# EAGLE schematic bms 5 (EAGLE 9.6.2)
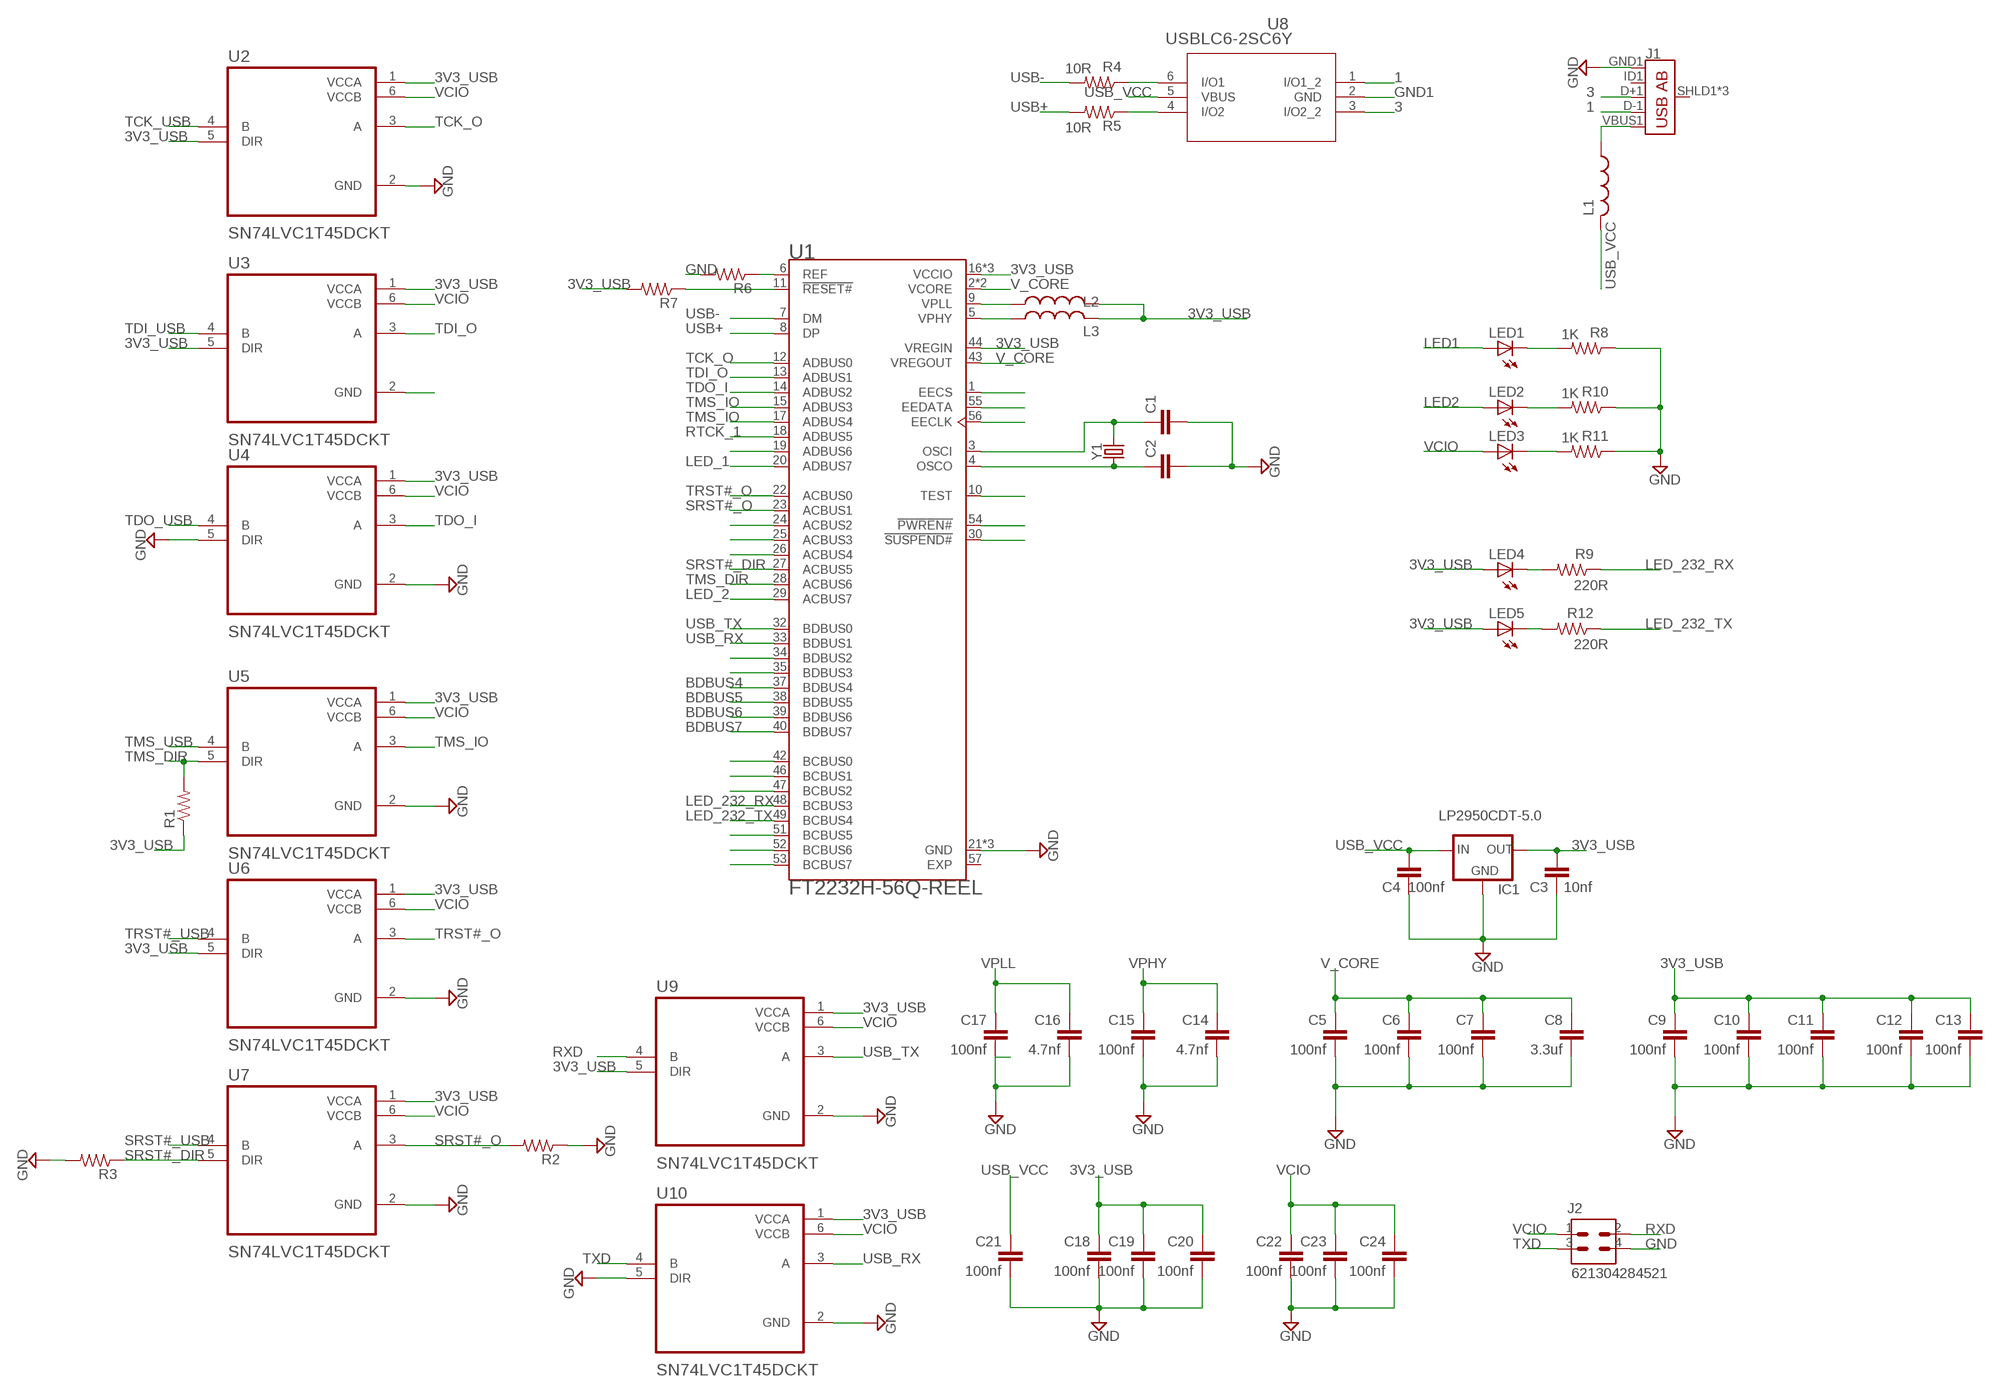
[diagram p0: schematic, sheet 1]

## Parts
C1  C-EUC0603  [C0603]
C2  C-EUC0603  [C0603]
C3  10nf  C-EUC0603  [C0603]
C4  100nf  C-EUC0603  [C0603]
C5  100nf  C-EUC0603  [C0603]
C6  100nf  C-EUC0603  [C0603]
C7  100nf  C-EUC0603  [C0603]
C8  3.3uf  C-EUC0603  [C0603]
C9  100nf  C-EUC0603  [C0603]
C10  100nf  C-EUC0603  [C0603]
C11  100nf  C-EUC0603  [C0603]
C12  100nf  C-EUC0603  [C0603]
C13  100nf  C-EUC0603  [C0603]
C14  4.7nf  C-EUC0603  [C0603]
C15  100nf  C-EUC0603  [C0603]
C16  4.7nf  C-EUC0603  [C0603]
C17  100nf  C-EUC0603  [C0603]
C18  100nf  C-EUC0603  [C0603]
C19  100nf  C-EUC0603  [C0603]
C20  100nf  C-EUC0603  [C0603]
C21  100nf  C-EUC0603  [C0603]
C22  100nf  C-EUC0603  [C0603]
C23  100nf  C-EUC0603  [C0603]
C24  100nf  C-EUC0603  [C0603]
IC1  LP2950CDT-5.0  [DPACK]
J1  USB_AB_SMT  [USB-AB-MICRO-SMD]
J2  621304284521  [621304284521]
L1  L-USL2012C  [L2012C]
L2  L-USL2012C  [L2012C]
L3  L-USL2012C  [L2012C]
LED1  LED  [SMARTLED-TTW]
LED2  LED  [SMARTLED-TTW]
LED3  LED  [SMARTLED-TTW]
LED4  LED  [SMARTLED-TTW]
LED5  LED  [SMARTLED-TTW]
R1  R-US_M0805  [M0805]
R2  R-US_M0805  [M0805]
R3  R-US_M0805  [M0805]
R4  10R  R-US_M0805  [M0805]
R5  10R  R-US_M0805  [M0805]
R6  12K  R-US_M0805  [M0805]
R7  1K  R-US_M0805  [M0805]
R8  1K  R-US_M0805  [M0805]
R9  220R  R-US_M0805  [M0805]
R10  1K  R-US_M0805  [M0805]
R11  1K  R-US_M0805  [M0805]
R12  220R  R-US_M0805  [M0805]
U1  FT2232H-56Q-REEL  [QFN50P800X800X100-57N]
U2  SN74LVC1T45DCKT  [SOT65P210X110-6N]
U3  SN74LVC1T45DCKT  [SOT65P210X110-6N]
U4  SN74LVC1T45DCKT  [SOT65P210X110-6N]
U5  SN74LVC1T45DCKT  [SOT65P210X110-6N]
U6  SN74LVC1T45DCKT  [SOT65P210X110-6N]
U7  SN74LVC1T45DCKT  [SOT65P210X110-6N]
U8  USBLC6-2SC6Y  [SOT23-6L_STM]
U9  SN74LVC1T45DCKT  [SOT65P210X110-6N]
U10  SN74LVC1T45DCKT  [SOT65P210X110-6N]
Y1  CRYSTAL-12MHZ  [CRYSTAL-SMD-2X2.5MM]

## Nets
1: J1.D-1(D-) U8.1(I/O1_2)
3: J1.D+1(D+) U8.3(I/O2_2)
3V3_USB: C3.2 C9.2 C10.2 C11.2 C12.2 C13.2 C18.2 C19.2 C20.2 IC1.3(OUT) L2.2 L3.2 LED4.A@1(A) LED5.A@1(A) R1.1 R7.2 U1.16(VCCIO) U1.36(VCCIO) U1.44(VREGIN) U1.50(VCCIO) U2.1(VCCA) U2.5(DIR) U3.1(VCCA) U3.5(DIR) U4.1(VCCA) U5.1(VCCA) U6.1(VCCA) U6.5(DIR) U7.1(VCCA) U9.1(VCCA) U9.5(DIR) U10.1(VCCA)
BDBUS4: U1.37(BDBUS4)
BDBUS5: U1.38(BDBUS5)
BDBUS6: U1.39(BDBUS6)
BDBUS7: U1.40(BDBUS7)
EECLK: U1.56(EECLK)
EECS: U1.1(EECS)
EEDATA: U1.55(EEDATA)
GND: C1.2 C2.2 C3.1 C4.1 C5.1 C6.1 C7.1 C8.1 C9.1 C10.1 C11.1 C12.1 C13.1 C14.1 C15.1 C16.1 C17.1 C18.1 C19.1 C20.1 C21.1 C22.1 C23.1 C24.1 IC1.4(GND) J1.GND1(GND) J2.4 R2.1 R3.2 R6.2 R8.1 R10.1 R11.1 U1.21(GND) U1.41(GND) U1.45(GND) U2.2(GND) U4.2(GND) U4.5(DIR) U5.2(GND) U6.2(GND) U7.2(GND) U9.2(GND) U10.2(GND) U10.5(DIR)
GND1: U8.2(GND)
LED1: LED1.A@1(A)
LED2: LED2.A@1(A)
LED_1: U1.20(ADBUS7)
LED_2: U1.29(ACBUS7)
LED_232_RX: R9.1 U1.48(BCBUS3)
LED_232_TX: R12.1 U1.49(BCBUS4)
N$1: J1.VBUS1(VBUS) L1.1
N$2: L2.1 U1.9(VPLL)
N$3: L3.1 U1.5(VPHY)
N$4: C2.1 U1.4(OSCO) Y1.P1
N$5: C1.1 U1.3(OSCI) Y1.P3
N$6: R6.1 U1.6(REF)
N$7: U1.19(ADBUS6)
N$8: R4.1 U8.6(I/O1)
N$9: U1.10(TEST)
N$10: R5.1 U8.4(I/O2)
N$11: U1.24(ACBUS2)
N$12: U1.25(ACBUS3)
N$13: U1.26(ACBUS4)
N$14: U3.2(GND)
N$15: R7.1 U1.11(!RESET#)
N$16: U1.54(!PWREN#)
N$17: U1.30(!SUSPEND#)
N$21: U1.34(BDBUS2)
N$22: U1.35(BDBUS3)
N$24: LED1.C@1(C) R8.2
N$25: U1.42(BCBUS0)
N$26: U1.46(BCBUS1)
N$27: U1.47(BCBUS2)
N$28: LED2.C@1(C) R10.2
N$29: LED3.C@1(C) R11.2
N$30: U1.51(BCBUS5)
N$31: U1.52(BCBUS6)
N$32: U1.53(BCBUS7)
N$36: LED4.C@1(C) R9.2
N$37: LED5.C@1(C) R12.2
RTCK_1: U1.18(ADBUS5)
RXD: J2.2 U9.4(B)
SRST#_DIR: R3.1 U1.27(ACBUS5) U7.5(DIR)
SRST#_O: R2.2 U1.23(ACBUS1) U7.3(A)
SRST#_USB: U7.4(B)
TCK_O: U1.12(ADBUS0) U2.3(A)
TCK_USB: U2.4(B)
TDI_O: U1.13(ADBUS1) U3.3(A)
TDI_USB: U3.4(B)
TDO_I: U1.14(ADBUS2) U4.3(A)
TDO_USB: U4.4(B)
TMS_DIR: R1.2 U1.28(ACBUS6) U5.5(DIR)
TMS_IO: U1.15(ADBUS3) U1.17(ADBUS4) U5.3(A)
TMS_USB: U5.4(B)
TRST#_O: U1.22(ACBUS0) U6.3(A)
TRST#_USB: U6.4(B)
TXD: J2.3 U10.4(B)
USB+: R5.2 U1.8(DP)
USB-: R4.2 U1.7(DM)
USB_RX: U1.33(BDBUS1) U10.3(A)
USB_TX: U1.32(BDBUS0) U9.3(A)
USB_VCC: C4.2 C21.2 IC1.1(IN) L1.2 U8.5(VBUS)
V_CORE: C5.2 C6.2 C7.2 C8.2 U1.2(VCORE) U1.31(VCORE) U1.43(VREGOUT)
VCIO: C22.2 C23.2 C24.2 J2.1 LED3.A@1(A) U2.6(VCCB) U3.6(VCCB) U4.6(VCCB) U5.6(VCCB) U6.6(VCCB) U7.6(VCCB) U9.6(VCCB) U10.6(VCCB)
VPHY: C14.2 C15.2
VPLL: C16.2 C17.2
Unconnected: J1.ID1(USBID) J1.SHLD1(SHIELD) J1.SHLD2(SHIELD) J1.SHLD3(SHIELD)

## Power pins joined to a net without a drawn wire
EXP: U1.57(EXP)

## Library data of the parts
C1-C24 = rcl:C-EU: CAPACITOR, European symbol; SPICEPREFIX: C
IC1 = v-reg:LP2950?*: Source: http://cache.national.com/ds/LP/LP2950.pdf
J1 = SparkFun-Connectors:USB_AB: USB Type AB Micro Connector OTG-compatible. 5 pins, 3 shield pins SparkFun Products: IOIO-OTG <https://www.sparkfun.com/products/13613> SparkFun SAMD21 Mini Breakout <https://www.sparkfun.com/products/13664>; PROD_ID: CONN-11794
J2 = Headers:621304284521: 2.00mm SMT Angled Dual Pin Header WR-PHD Manufacturer's datasheet <https://katalog.we-online.com/em/datasheet/621304284521.pdf>; CREATED_BY: PCBLayout.com; MANUFACTURER: Wurth Elektronik; MPN: 621304284521
L1-L3 = rcl:L-US: INDUCTOR, American symbol; SPICEPREFIX: L
LED1-LED5 = adafruit:LED: LED OSRAM: - CHIPLED LG R971, LG N971, LY N971, LG Q971, LY Q971, LO R971, LY R971 LH N974, LH R974 LS Q976, LO Q976, LY Q976 LO Q996 - Hyper CHIPLED LW Q18S LB Q993, LB Q99A, LB R99A - SideLED LS A670, LO A670, LY A670, LG A670, LP A670 LB A673, LV A673, LT A673, LW A673 LH A674 LY A675 LS A676, LA A676, LO A676, LY A676, LW A676 LS A679, LY A679, LG A679 - Hyper Micro SIDELED® LS Y876, LA Y876, LO Y876, LY Y876 LT Y87S - SmartLED LW L88C, LW L88S LB L89C, LB L89S, LG L890 LS L89K, LO L89K, LY L89K LS L896, LA L896, LO L896, LY L896 - TOPLED LS T670, LO T670, LY T670, LG T670, LP T670 LSG T670, LSP T670, LSY T670, LOP T670, LYG T670 LG T671, LOG T671, LSG T671 LB T673, LV T673, LT T673, LW T673 LH T674 LS T676, LA T676, LO T676, LY T676, LB T676, LH T676, LSB T676, LW T676 LB T67C, LV T67C, LT T67C, LS T67K, LO T67K, LY T67K, LW E67C LS E67B, LA E67B, LO E67B, LY E67B, LB E67C, LV E67C, LT E67C LW T67C LS T679, LY T679, LG T679 LS T770, LO T770, LY T770, LG T770, LP T770 LB T773, LV T773, LT T773, LW T773 LH T774 LS E675, LA E675, LY E675, LS T675 LS T776, LA T776, LO T776, LY T776, LB T776 LHGB T686 LT T68C, LB T68C - Hyper Mini TOPLED® LB M676 - Mini TOPLED Santana® LG M470 LS M47K, LO M47K, LY M47K Source: http://www.osram.convergy.de/
R1-R12 = rcl:R-US_: RESISTOR, American symbol; SPICEPREFIX: R
U1 = FT2232H-56Q-REEL:FT2232H-56Q-REEL: Interface Bridge, Usb-Uart/Fifo, Qfn-56 Check availability <https://pricing.snapeda.com/parts/FT2232H-56Q-REEL/FTDI%2C/view-part?ref=eda>; AVAILABILITY: In Stock; DESCRIPTION: USB Bridge, USB to UART,FIFO USB 2.0 UART, FIFO Interface 56-VQFN (8x8); MF: FTDI,; MP: FT2232H-56Q-REEL; PACKAGE: VQFN-56 FTDI; PRICE: None; PURCHASE-URL: https://pricing.snapeda.com/search/part/FT2232H-56Q-REEL/?ref=eda
U2-U7 U9 U10 = SN74LVC1T45DCKT:SN74LVC1T45DCKT: Check availability <https://pricing.snapeda.com/parts/SN74LVC1T45DCKT/Texas%20Instruments/view-part?ref=eda>; AVAILABILITY: In Stock; DESCRIPTION: Single-Bit Dual-Supply Bus Transceiver with Configurable Voltage-Level Shifting and 3-State Outputs; MF: Texas Instruments; MP: SN74LVC1T45DCKT; PACKAGE: SOT-SC70-6 Texas Instruments; PRICE: None; PURCHASE-URL: https://pricing.snapeda.com/search/part/SN74LVC1T45DCKT/?ref=eda
U8 = USBLC6-2SC6Y:USBLC6-2SC6Y; COPYRIGHT: Copyright (C) 2021 Ultra Librarian. All rights reserved.; MANUFACTURER_PART_NUMBER: USBLC6-2SC6Y; MFR_NAME: STMicroelectronics
Y1 = SparkFun-Clocks:CRYSTAL-12MHZ: 12.0MHz Crystal Frequency: 12.0MHz Frequency Tolerance: ±20ppm Load Capacitance: 18pF SparkFun Products: SparkFun Logomatic <https://www.sparkfun.com/products/12772> Pocket AVR Programmer <https://www.sparkfun.com/products/9825>; PROD_ID: XTAL-15540